# EAGLE design SFT_MotorController1.0v (EAGLE 7.5.0)
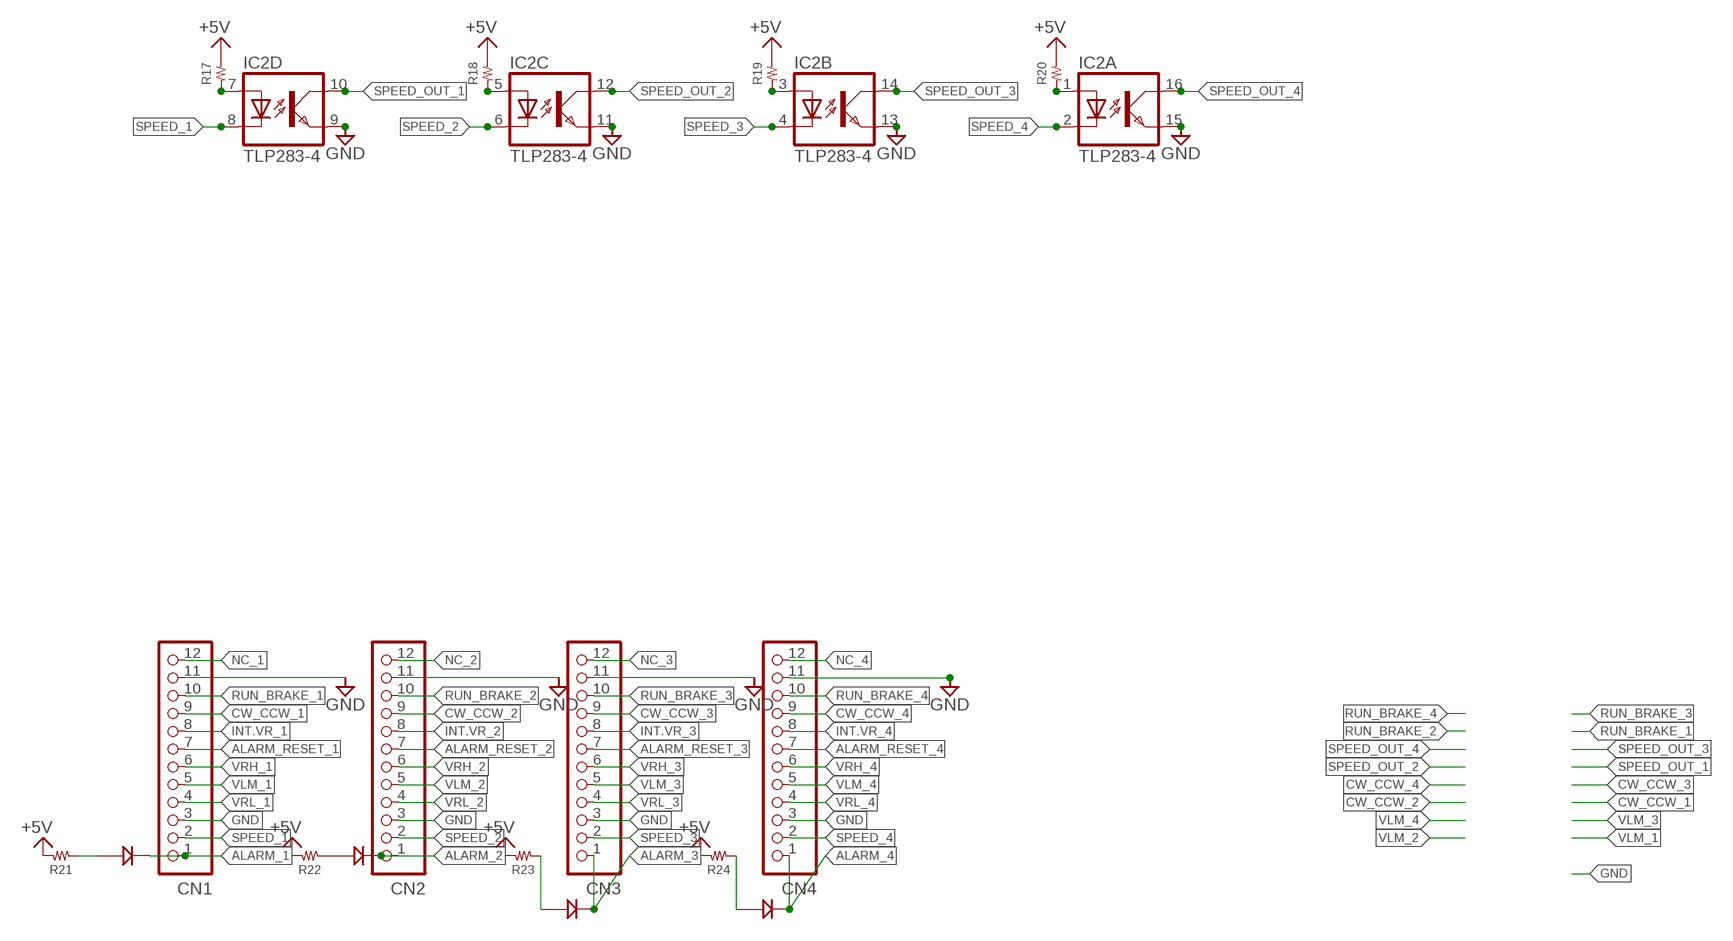
[diagram p0: schematic, sheet 1, part 1 of 2]
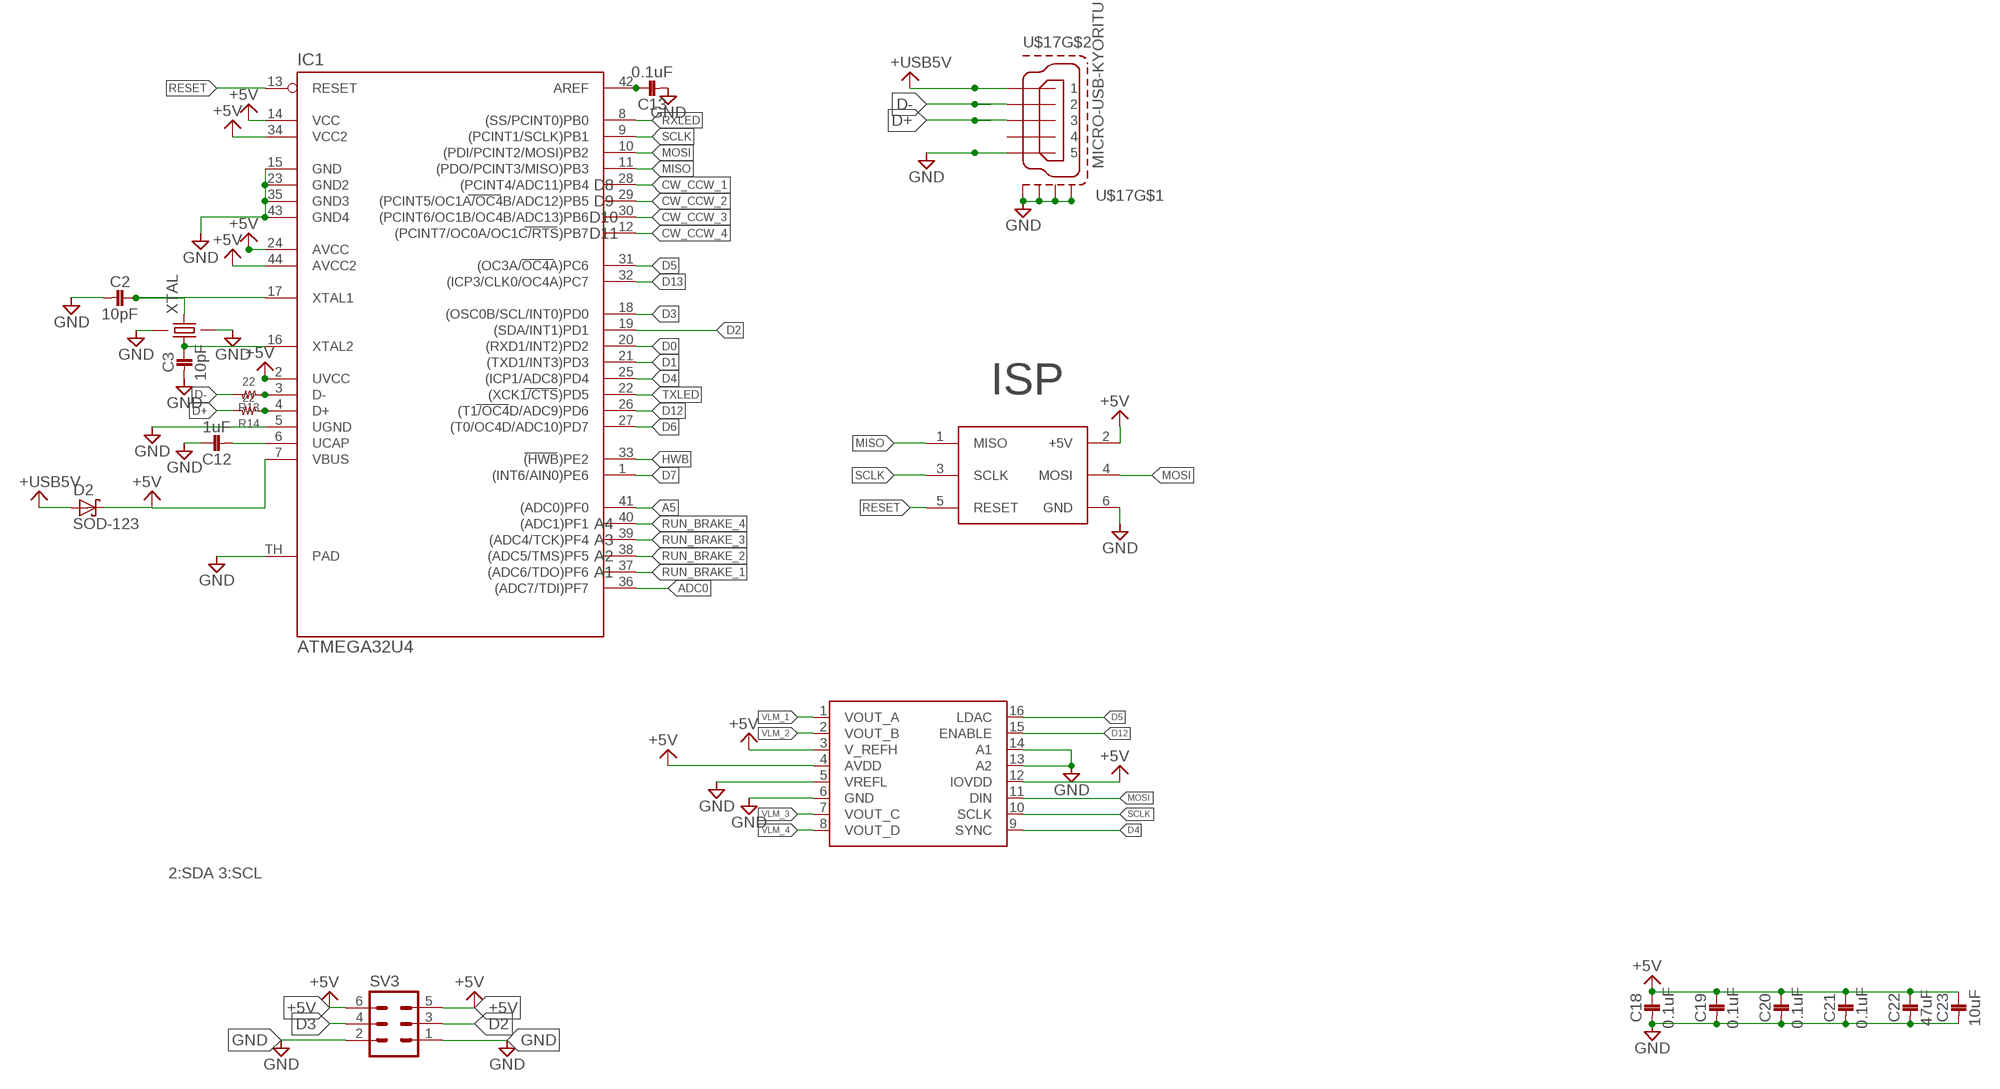
[diagram p1: schematic, sheet 1, part 2 of 2]

## Parts
C2  10pF  1005  [1005]
C3  10pF  1005  [1005]
C12  1uF  1005  [1005]
C13  0.1uF  1005  [1005]
C18  0.1uF  1005  [1005]
C19  0.1uF  1005  [1005]
C20  0.1uF  1005  [1005]
C21  0.1uF  1005  [1005]
C22  47uF  1608  [1608]
C23  10uF  1608  [1608]
CN1  B12B-XASK-1  [B12B-XASK-1]
CN2  B12B-XASK-1  [B12B-XASK-1]
CN3  B12B-XASK-1  [B12B-XASK-1]
CN4  B12B-XASK-1  [B12B-XASK-1]
D2  SOD-123  [SOD_123]
IC1  ATMEGA32U4  [QFN-44-7X7]
IC2  TLP283-4  [MINI-FLAT-16]
IC3  DAC7564  [TSSOP16]
R13  22  RESISTOR_1005  [1005]
R14  22  RESISTOR_1005  [1005]
R17  RESISTOR__SMD  [1608]
R18  RESISTOR__SMD  [1608]
R19  RESISTOR__SMD  [1608]
R20  RESISTOR__SMD  [1608]
R21  RESISTOR__SMD  [1608]
R22  RESISTOR__SMD  [1608]
R23  RESISTOR__SMD  [1608]
R24  RESISTOR__SMD  [1608]
SV3  ML6  [ML6]
U$8  ICSP  [ICSP]
U$17  MICRO-USB-KYORITU  [ZX62R-B-5P]
U$36  3MMLED  [3MM]
U$37  3MMLED  [3MM]
U$38  3MMLED  [3MM]
U$39  3MMLED  [3MM]
XTAL  FA-238  [FA-238]

## Nets
+5V: C18.1 C19.1 C20.1 C21.1 C22.P$1 C23.P$1 D2.C IC1.2(UVCC) IC1.7(VBUS) IC1.14(VCC) IC1.24(AVCC) IC1.34(VCC2) IC1.44(AVCC2) IC3.3(V_REFH) IC3.4(AVDD) IC3.12(IOVDD) R17.2 R18.2 R19.2 R20.2 R21.2 R22.2 R23.2 R24.2 SV3.5 SV3.6 U$8.2(+5V)
+USB5V: D2.A U$17.5
A5: IC1.41((ADC0)PF0)
ADC0: IC1.36((ADC7/TDI)PF7)
ALARM_1: CN1.1 U$37.K
ALARM_2: CN2.1 U$38.K
ALARM_3: CN3.1 U$36.K
ALARM_4: CN4.1 U$39.K
ALARM_RESET_1: CN1.7
ALARM_RESET_2: CN2.7
ALARM_RESET_3: CN3.7
ALARM_RESET_4: CN4.7
CW_CCW_1: CN1.9 IC1.28((PCINT4/ADC11)PB4)
CW_CCW_2: CN2.9 IC1.29((PCINT5/OC1A/OC4B/ADC12)PB5)
CW_CCW_3: CN3.9 IC1.30((PCINT6/OC1B/OC4B/ADC13)PB6)
CW_CCW_4: CN4.9 IC1.12((PCINT7/OC0A/OC1C/RTS)PB7)
D0: IC1.20((RXD1/INT2)PD2)
D1: IC1.21((TXD1/INT3)PD3)
D2: IC1.19((SDA/INT1)PD1) SV3.3
D3: IC1.18((OSC0B/SCL/INT0)PD0) SV3.4
D4: IC1.25((ICP1/ADC8)PD4) IC3.9(SYNC)
D5: IC1.31((OC3A/OC4A)PC6) IC3.16(LDAC)
D6: IC1.27((T0/OC4D/ADC10)PD7)
D7: IC1.1((INT6/AIN0)PE6)
D12: IC1.26((T1/OC4D/ADC9)PD6) IC3.15(ENABLE)
D13: IC1.32((ICP3/CLK0/OC4A)PC7)
D+: R14.2 U$17.3
D-: R13.2 U$17.4
GND: C2.2 C3.2 C12.1 C13.2 C18.2 C19.2 C20.2 C21.2 C22.P$2 C23.P$2 CN1.3 CN1.11 CN2.3 CN2.11 CN3.3 CN3.11 CN4.3 CN4.11 IC1.5(UGND) IC1.15(GND) IC1.23(GND2) IC1.35(GND3) IC1.43(GND4) IC1.TH(PAD) IC2.9(D:EMIT) IC2.11(C:EMIT) IC2.13(B:EMIT) IC2.15(A:EMIT) IC3.5(VREFL) IC3.6(GND) IC3.13(A2) IC3.14(A1) SV3.1 SV3.2 U$8.6(GND) U$17.1 U$17.M1(S1) U$17.M2(S2) U$17.M3(S3) U$17.M4(S4) XTAL.2 XTAL.4
HWB: IC1.33((HWB)PE2)
INT.VR_1: CN1.8
INT.VR_2: CN2.8
INT.VR_3: CN3.8
INT.VR_4: CN4.8
MISO: IC1.11((PDO/PCINT3/MISO)PB3) U$8.1(MISO)
MOSI: IC1.10((PDI/PCINT2/MOSI)PB2) IC3.11(DIN) U$8.4(MOSI)
N$1: IC1.3(D-) R13.1
N$2: IC1.4(D+) R14.1
N$3: C3.1 IC1.16(XTAL2) XTAL.1
N$4: R22.1 U$38.A
N$5: IC2.3(B:A) R19.1
N$6: IC2.5(C:A) R18.1
N$7: IC2.7(D:A) R17.1
N$8: IC2.1(A:A) R20.1
N$9: C13.1 IC1.42(AREF)
N$10: C2.1 IC1.17(XTAL1) XTAL.3
N$13: R21.1 U$37.A
N$15: R23.1 U$36.A
N$16: R24.1 U$39.A
N$18: C12.2 IC1.6(UCAP)
NC_1: CN1.12
NC_2: CN2.12
NC_3: CN3.12
NC_4: CN4.12
RESET: IC1.13(RESET) U$8.5(RESET)
RUN_BRAKE_1: CN1.10 IC1.37((ADC6/TDO)PF6)
RUN_BRAKE_2: CN2.10 IC1.38((ADC5/TMS)PF5)
RUN_BRAKE_3: CN3.10 IC1.39((ADC4/TCK)PF4)
RUN_BRAKE_4: CN4.10 IC1.40((ADC1)PF1)
RXLED: IC1.8((SS/PCINT0)PB0)
SCLK: IC1.9((PCINT1/SCLK)PB1) IC3.10(SCLK) U$8.3(SCLK)
SPEED_1: CN1.2 IC2.8(D:C)
SPEED_2: CN2.2 IC2.6(C:C)
SPEED_3: CN3.2 IC2.4(B:C)
SPEED_4: CN4.2 IC2.2(A:C)
SPEED_OUT_1: IC2.10(D:COL)
SPEED_OUT_2: IC2.12(C:COL)
SPEED_OUT_3: IC2.14(B:COL)
SPEED_OUT_4: IC2.16(A:COL)
TXLED: IC1.22((XCK1/CTS)PD5)
VLM_1: CN1.5 IC3.1(VOUT_A)
VLM_2: CN2.5 IC3.2(VOUT_B)
VLM_3: CN3.5 IC3.7(VOUT_C)
VLM_4: CN4.5 IC3.8(VOUT_D)
VRH_1: CN1.6
VRH_2: CN2.6
VRH_3: CN3.6
VRH_4: CN4.6
VRL_1: CN1.4
VRL_2: CN2.4
VRL_3: CN3.4
VRL_4: CN4.4
Unconnected: U$17.2

## Notes on the sheet
- D8
- D9
- D10
- D11
- ISP
- A4
- A3
- A2
- A1
- 2:SDA 3:SCL

## Library data of the parts
C2 C3 C12 C13 C18-C21 = 02_C:1005
C22 C23 = 02_C:1608
CN1-CN4 = jst-xa:B12B-XASK-1: Wire-to-Board 2.5mm pitch top mount connector Source: http://www.jst-mfg.com/product/pdf/jpn/XA1.pdf http://www.jst-mfg.com/product/detail.php?series=272
D2 = 15_DIODE:SOD-123
IC1 = 04_IC:ATMEGA32U4
IC2 = optocoupler:TLP283-4: TOSHIBA PHOTOCOUPLER GaAs IRED & PHOTO-TRANSISTOR Source: http://www.semicon.toshiba.co.jp/td/en/Opto/Photocoupler/en_20050928_TLP283_datasheet.pdf; OC_FARNELL: unknown; OC_NEWARK: unknown
IC3 = 04_IC:DAC7564
R13 R14 = 01_R:RESISTOR_1005
R17-R24 = 01_R:RESISTOR__SMD
SV3 = con-ml:ML6: HARTING; OC_FARNELL: unknown; OC_NEWARK: unknown
U$8 = 08_CONECTOR:ICSP
U$17 = con-hirose1:MICRO-USB-KYORITU
U$36-U$39 = 10_LED:3MMLED
XTAL = 09_2_CRYSTAL:FA-238

## Board
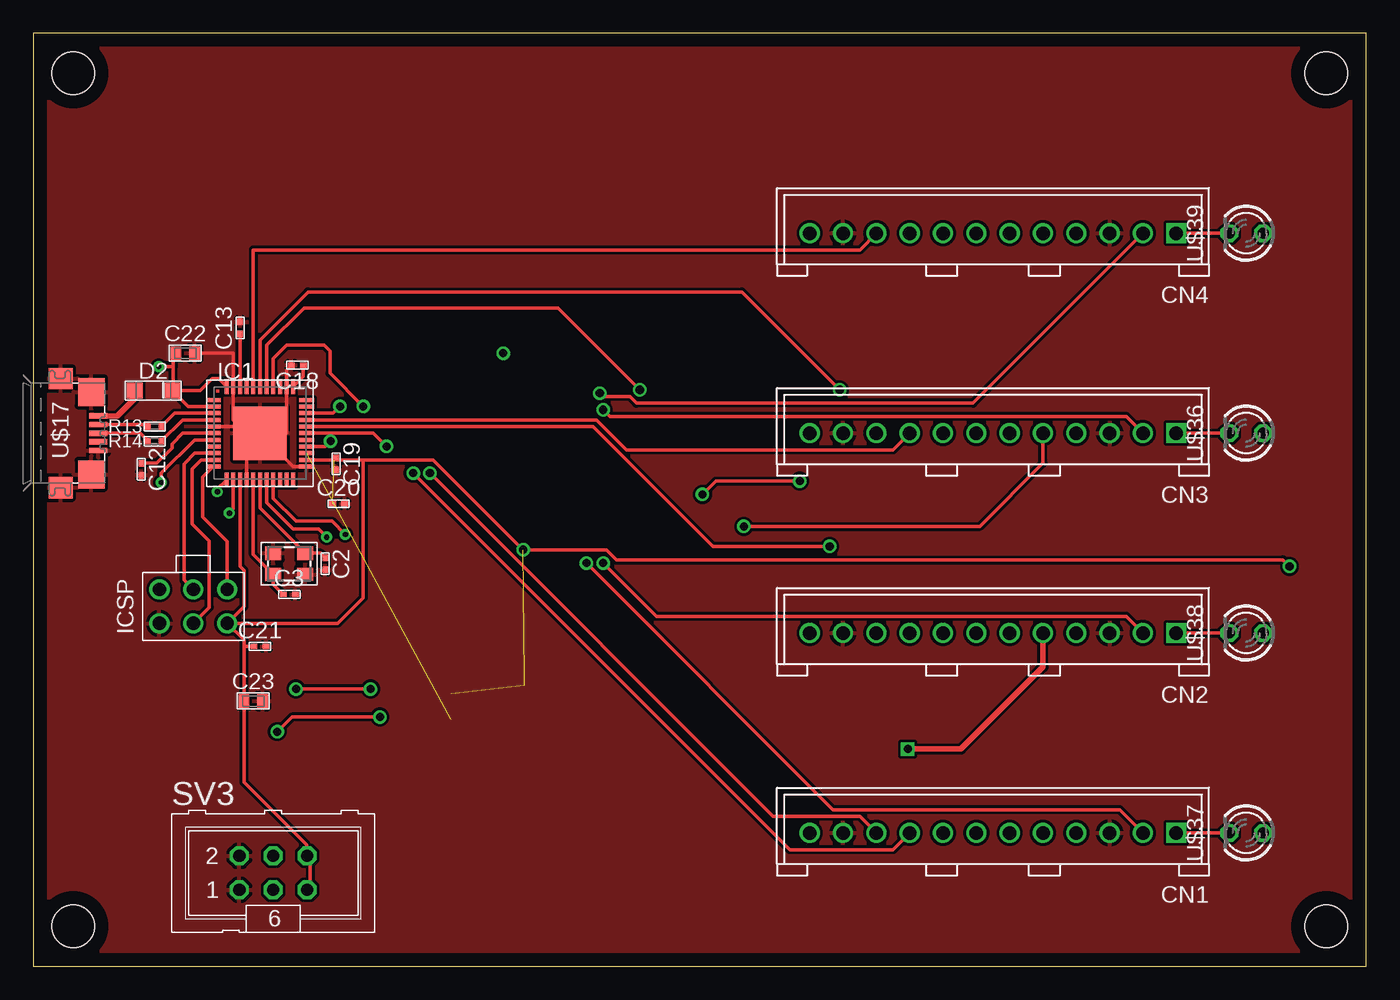
[diagram p2: board, top side]
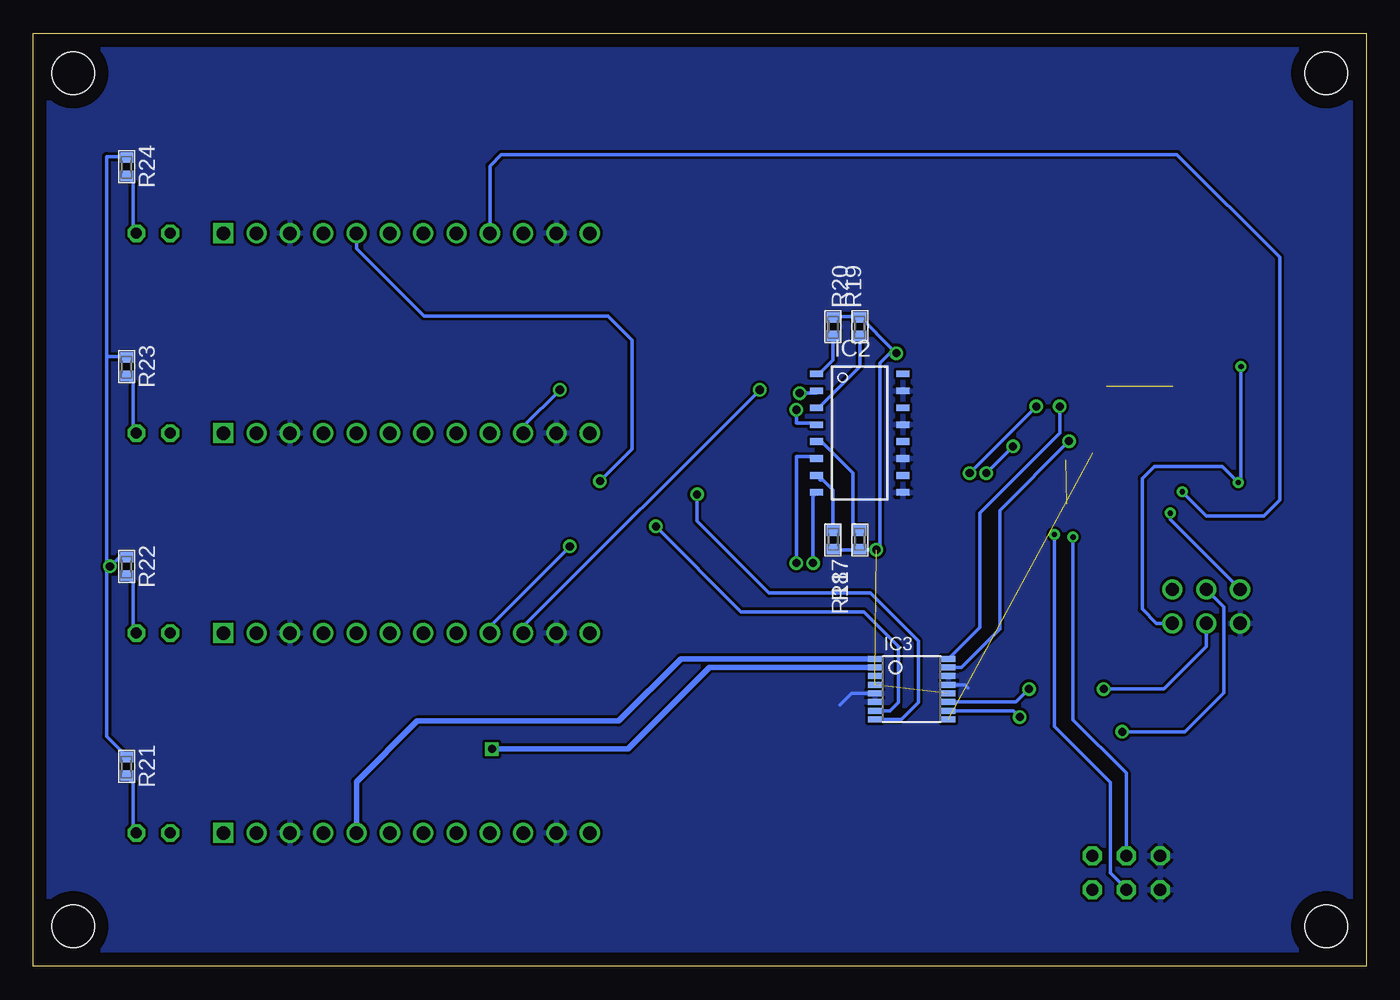
[diagram p3: board, bottom side, seen from below]

Size 100 x 70 mm. Coordinates in mm from the lower left corner, seen from the top.
Outline: 100,70 0,70 0,0 100,0 100,70
Copper layers (1*16): Top 0.035mm / dielectric 1.5mm / Bottom 0.035mm
Design rules "default": minimum track width 10mil, minimum drill 24mil, track to track 8mil, track to pad 8mil, pad to pad 8mil, via to via 8mil, smd to smd 8mil, copper to edge 40mil, drill to drill 8mil, minimum pad ring 10mil, minimum via ring 8mil, stop-mask expansion 4mil, vias tented up to drill 0mil, thermal gap 10mil
Holes 3.2 mm at 97,3 97,67 3,67 3,3

### Footprints (pad centres in the part's own frame; a part is rotated, then mirrored left to right if it is on the bottom)
1005 = smd 0.5 x 0.4: 1 -0.45,0; 2 0.45,0
1608 = smd 0.8 x 1: P$1 -0.7,0; P$2 0.7,0
B12B-XASK-1 = drill 1.016 square: 1 -13.75,0 | drill 1.016: 2 -11.25,0; 3 -8.75,0; 4 -6.25,0; 5 -3.75,0; 6 -1.25,0; 7 1.25,0; 8 3.75,0; 9 6.25,0; 10 8.75,0; 11 11.25,0; 12 13.75,0
SOD_123 = smd 1.2 x 1.2: A -1.4,0; C 1.4,0
QFN-44-7X7 = smd 1.1 x 0.3: 1 -3.5,2.5; 2 -3.5,2; 3 -3.5,1.5; 4 -3.5,1; 5 -3.5,0.5; 6 -3.5,0; 7 -3.5,-0.5; 8 -3.5,-1; 9 -3.5,-1.5; 10 -3.5,-2; 11 -3.5,-2.5; 23 3.5,-2.5; 24 3.5,-2; 25 3.5,-1.5; 26 3.5,-1; 27 3.5,-0.5; 28 3.5,0; 29 3.5,0.5; 30 3.5,1; 31 3.5,1.5; 32 3.5,2; 33 3.5,2.5 | smd 0.3 x 1.1: 12 -2.5,-3.5; 13 -2,-3.5; 14 -1.5,-3.5; 15 -1,-3.5; 16 -0.5,-3.5; 17 0,-3.5; 18 0.5,-3.5; 19 1,-3.5; 20 1.5,-3.5; 21 2,-3.5; 22 2.5,-3.5; 34 2.5,3.5; 35 2,3.5; 36 1.5,3.5; 37 1,3.5; 38 0.5,3.5; 39 0,3.5; 40 -0.5,3.5; 41 -1,3.5; 42 -1.5,3.5; 43 -2,3.5; 44 -2.5,3.5 | smd 4 x 4: TH 0,0
MINI-FLAT-16 = smd 1 x 0.5: 1 -3.24,4.445; 2 -3.24,3.175; 3 -3.24,1.905; 4 -3.24,0.635; 5 -3.24,-0.635; 6 -3.24,-1.905; 7 -3.24,-3.175; 8 -3.24,-4.445; 9 3.24,-4.445; 10 3.24,-3.175; 11 3.24,-1.905; 12 3.24,-0.635; 13 3.24,0.635; 14 3.24,1.905; 15 3.24,3.175; 16 3.24,4.445
TSSOP16 = smd 0.45 x 1.05: 1 -2.275,-2.768; 2 -1.625,-2.768; 3 -0.975,-2.768; 4 -0.325,-2.768; 5 0.325,-2.768; 6 0.975,-2.768; 7 1.625,-2.768; 8 2.275,-2.768; 9 2.275,2.768; 10 1.625,2.768; 11 0.975,2.768; 12 0.325,2.768; 13 -0.325,2.768; 14 -0.975,2.768; 15 -1.625,2.768; 16 -2.275,2.768
1005' = smd 0.4 x 0.5: 1 -0.5,0; 2 0.5,0
1608' = smd 0.8 x 1: 1 -0.7,0; 2 0.7,0
ML6 = drill 0.914 octagon: 1 -2.54,-1.27; 2 -2.54,1.27; 3 0,-1.27; 4 0,1.27; 5 2.54,-1.27; 6 2.54,1.27
ICSP = drill 1 pad 1.5: 1 -1.27,2.54; 2 1.27,2.54; 3 -1.27,0; 4 1.27,0; 5 -1.27,-2.54; 6 1.27,-2.54
ZX62R-B-5P = smd 1.35 x 0.4: 1 2.875,-1.3; 2 2.875,-0.65; 3 2.875,0; 4 2.875,0.65; 5 2.875,1.3 | smd 1.8 x 1.6: M1 0.05,-4.1; M2 0.05,4.1 | smd 2 x 2.1: M3 2.35,3.1; M4 2.35,-3.1
3MM = drill 0.813 octagon: A 0,1.27; K 0,-1.27
FA-238 = smd 1.2 x 1: 1 -1.2,-0.8; 2 1.2,-0.8; 3 1.2,0.8; 4 -1.2,0.8

### Placement (x,y rotation side)
C2  21.9,30.2 270 top
C3  19.2,27.9 0 top
C12  8.1,37.3 90 top
C13  15.5,47.9 90 top
C18  19.8,45.1 180 top
C19  22.7,37.7 270 top
C20  22.9,34.7 0 top
C21  17,24 0 top
C22  11.4,46 0 top
C23  16.5,19.9 0 top
CN1  72,10 180 top
CN2  72,25 180 top
CN3  72,40 180 top
CN4  72,55 180 top
D2  9,43.2 0 top
IC1  17,40 0 top
IC2  38,40 0 bottom
IC3  34.1,20.8 270 bottom
R13  22  [1005']  9.1,40.5 180 top
R14  22  [1005']  9.1,39.4 180 top
R17  [1608']  40,32 270 bottom
R18  [1608']  38,32 270 bottom
R19  [1608']  38,48 90 bottom
R20  [1608']  40,48 90 bottom
R21  [1608']  93,15 90 bottom
R22  [1608']  93,30 90 bottom
R23  [1608']  93,45 90 bottom
R24  [1608']  93,60 90 bottom
SV3  18,7 0 top
U$8  12,27 270 top
U$17  2,40 0 top
U$36  91,40 270 top
U$37  91,10 270 top
U$38  91,25 270 top
U$39  91,55 270 top
XTAL  19.2,30.2 0 top

### Tracks (layer width: path | path; a pad name or v marks a point on that pad's centre or on a via)
+5V  (via drill 0.4, 0.61)  (5 unrouted)
  Top 0.25: IC1.14 15.5,30 15.8,29.7 15.8,26.99 U$8.2 | IC1.2 11.6,42 D2.C 12.5,43.2 13.4,44.1 13.9,44.1 IC1.44 | IC1.24 22.55,38 C19.1 | IC1.7 12.1,39.5 9.6,37 v9.6,36.3 | v9.4,45 10.5,45 | 24.75,38 24.75,27.65 22.83,25.73 U$8.2 | IC1.34 20.25,44.25 C18.1 | 20.5,8.5 20.5,9.1 15.8,13.8 C23.P$1 15.8,24 | 15.8,24 15.8,24.47 U$8.2 | C21.1 15.8,24
  Top 0.254: C19.1 22.75,38 24.75,38 30,38 v36.75,31.25 43,31.25 43.75,30.5 93.75,30.5 v94.25,30 | C22.P$1 10.5,46 10.5,45 10.5,43.25 D2.C | SV3.5 20.75,5.75 20.75,8.25 SV3.6 20.5,8.5
  Bottom 0.25: v9.4,45 9.4,36.5 v9.6,36.3 10.8,37.5 15.9,37.5 16.8,36.6 16.8,26.8 15.73,25.73 U$8.2
  Bottom 0.254: 94.5,29.75 94.5,17.25 93,15.75 R21.2 | 94.5,29.75 v94.25,30 93.5,30.75 93,30.75 R22.2 | 94.5,45.75 93,45.75 R23.2 | 94.5,29.75 94.5,45.75 | 94.5,45.75 94.5,60.75 93,60.75 R24.2 | 38,48.75 35.5,46.25 | 38,48.75 40,48.75 R20.2 | 38,48.75 R19.2 | 38,31.25 40,31.25 R17.2 | 38,31.25 v36.75,31.25 36.5,31.5 36.5,45.25 35.5,46.25 | 38,31.25 R18.2 | 35.5,46.25 v35.25,46
+USB5V
  Top 0.4: U$17.5 6.3,41.3 7.6,42.6 D2.A
ALARM_1
  Top 0.254: CN1.1 U$37.K
ALARM_2
  Top 0.254: CN2.1 U$38.K
ALARM_3
  Top 0.254: CN3.1 U$36.K
ALARM_4
  Top 0.254: CN4.1 U$39.K
CW_CCW_1  (via drill 0.61)
  Top 0.254: IC1.28 25.5,40 v26.5,39 | v28.5,37 56.75,8.75 64.5,8.75 CN1.9
  Bottom 0.254: v28.5,37 v26.5,39
CW_CCW_2  (via drill 0.61)
  Top 0.254: IC1.29 42,40.5 51,31.5 v59.75,31.5
  Bottom 0.254: v59.75,31.5 65.75,25.5 CN2.9
CW_CCW_3
  Top 0.254: IC1.30 42.25,41 44.5,38.75 64.5,38.75 CN3.9
CW_CCW_4  (via drill 0.4)
  Top 0.25: IC1.12 13.8,35.8 v13.8,35.6
  Bottom 0.25: v13.8,35.6 12,33.8 7.7,33.8 6.5,35 6.5,53.2 14.2,60.9 64.9,60.9 65.75,60.05 CN4.9
D2  (via drill 0.4)
  Top 0.25: IC1.19 18,35.1 19.7,33.4 22.4,33.4 v23.4,32.4
  Bottom 0.25: v23.4,32.4 23.4,18 19.2,13.8 19.2,7 18,5.8 SV3.3
D3  (via drill 0.4)
  Top 0.25: IC1.18 17.5,34.8 19.5,32.8 21.4,32.8 v22,32.2
  Bottom 0.25: v22,32.2 22,18.5 18,14.5 SV3.4
D4  (1 unrouted)
D5  (via drill 0.6)
  Top 0.25: v23,42 22.5,41.5 IC1.31
  Bottom 0.25: IC3.16 29,25.41 29,34 23,40 v23,42
D12  (via drill 0.6)
  Top 0.25: v22.3,39.4 21.9,39 IC1.26
  Bottom 0.25: IC3.15 30.38,22.43 27.5,25.3 27.5,34.2 v22.3,39.4
D+
  Top 0.25: R14.2 8,40 U$17.3
D-
  Top 0.25: R13.2 8.45,40.65 U$17.4
GND
  Top 0.25: IC1.5 15.5,40.5 | 15.5,40.5 16,40 | IC1.43 15,41 15.5,40.5 | C18.2 19,44.75 IC1.35 19,42 IC1.TH 19.5,37.5 IC1.23
  Top 0.254: IC1.15 16,40 IC1.TH 19,40 IC1.35 | IC1.43 15,46 C22.P$2
  Bottom 0.25: IC3.13 30.12,21.12 29.9,20.9 | IC3.5 38.62,20.48 39.5,19.6
  pour Bottom: 111,-4 -5,-4 -5,82 111,82
  pour Top: 115,-7 -11,-7 -11,84 115,84
MISO
  Top 0.25: IC1.11 12.7,36.7 12.7,33.7 14.54,31.86 U$8.1
MOSI  (via drill 0.6)
  Top 0.25: U$8.4 13.2,26.93 13.2,31.9 11.9,33.2 11.9,37.3 12.6,38 IC1.10 | v25.3,20.8 v19.7,20.8
  Bottom 0.25: IC3.11 26.27,19.82 v25.3,20.8 | v19.7,20.8 15.2,20.8 12,24 U$8.4
N$1
  Top 0.25: R13.1 10.6,41.5 IC1.3
N$2
  Top 0.25: R14.1 11.2,41 IC1.4
N$3
  Top 0.25: IC1.16 16.5,30.9 XTAL.1 18,28.65 C3.1
N$4
  Bottom 0.254: R22.1 93,29.25 92.5,28.75 92.5,25 U$38.A
N$5
  Bottom 0.254: R19.1 38,45 41,42 IC2.3
N$6
  Bottom 0.254: R18.1 38,32.75 38.5,33.25 38.5,37 41,39.5 IC2.5
N$7
  Bottom 0.254: R17.1 40,35.75 40.75,36.5 41,36.5 41,36.75 IC2.7
N$8
  Bottom 0.254: R20.1 40,45.5 41,44.5 IC2.1
N$9
  Top 0.254: IC1.42 C13.1
N$10
  Top 0.25: IC1.17 17,34.4 XTAL.3 21.55,31 C2.1
N$13
  Bottom 0.254: R21.1 93,14.25 92.5,13.75 92.5,10 U$37.A
N$15
  Bottom 0.254: R23.1 93,44.25 92.5,43.75 92.5,40 U$36.A
N$16
  Bottom 0.254: R24.1 93,59.25 92.5,58.75 92.5,55 U$39.A
N$18
  Top 0.25: IC1.6 11.2,40 10.4,39.2 10.4,38.9 9.25,37.75 C12.2
RESET  (via drill 0.4)
  Top 0.25: v14.7,34 15,34.3 IC1.13
  Bottom 0.25: U$8.5 14.7,33.51 v14.7,34
RUN_BRAKE_1  (via drill 0.61)
  Top 0.25: 18,44.5 18,45.6 19,46.6 21.8,46.6 22.25,46.15 22.25,44.5
  Top 0.254: 18,44.5 IC1.37 | v24.75,42 22.25,44.5 | v29.75,37 55.5,11.25 62,11.25 CN1.10
  Bottom 0.254: v29.75,37 v24.75,42
RUN_BRAKE_2  (via drill 0.61)
  Top 0.25: 44.12,44.62 39.35,49.4 20.3,49.4 17.5,46.6 17.5,45
  Top 0.254: 17.5,45 IC1.38 | v45.5,43.25 44.12,44.62 43.75,45
  Bottom 0.254: v45.5,43.25 63.25,25.5 CN2.10
RUN_BRAKE_3  (via drill 0.61)
  Top 0.25: 17,47 20.6,50.6 53.15,50.6 56.75,47
  Top 0.254: 17,47 IC1.39 | v60.5,43.25 56.75,47
  Bottom 0.254: v60.5,43.25 63.25,40.5 CN3.10
RUN_BRAKE_4
  Top 0.254: IC1.40 16.5,53.75 62,53.75 CN4.10
SCLK  (via drill 0.6)
  Top 0.25: U$8.3 11.3,28.97 11.3,37.7 12.1,38.5 IC1.9 | v26,18.7 19.4,18.7 v18.3,17.6
  Bottom 0.25: IC3.10 26.48,19.18 v26,18.7 | v18.3,17.6 13.6,17.6 10.7,20.5 10.7,26.97 U$8.3
SPEED_1  (via drill 0.61)
  Top 0.254: v41.5,30.25 60,11.75 81.5,11.75 CN1.2
  Bottom 0.254: v41.5,30.25 41.5,35.25 41.25,35.5 IC2.8
SPEED_2  (via drill 0.61)
  Top 0.254: v42.75,30.25 46.75,26.25 82,26.25 CN2.2
  Bottom 0.254: v42.75,30.25 42.75,38.25 41.25,38.25 IC2.6
SPEED_3  (via drill 0.61)
  Top 0.254: v42.75,41.75 43.25,41.25 82,41.25 CN3.2
  Bottom 0.254: v42.75,41.75 42.75,40.75 41.25,40.75 IC2.4
SPEED_4  (via drill 0.61)
  Top 0.254: v42.5,43 42.75,42.75 44.75,42.75 45.25,42.25 70.5,42.25 CN4.2
  Bottom 0.254: v42.5,43 41.25,43 IC2.2
VLM_1
  Bottom 0.406: IC3.1 51.42,23.07 56.1,18.4 71.2,18.4 75.75,13.85 CN1.5
VLM_2  (via drill 0.6)
  Top 0.406: v65.6,16.3 69.6,16.3 75.75,22.45 CN2.5
  Bottom 0.406: IC3.2 49.27,22.43 55.4,16.3 v65.6,16.3
VLM_3  (via drill 0.6)
  Top 0.25: v53.3,33 71,33 75.75,37.75 CN3.5
  Bottom 0.25: IC3.7 35.73,19.18 35.1,19.8 35.1,24 37.7,26.6 46.9,26.6 v53.3,33
VLM_4  (via drill 0.6)
  Top 0.25: v50.2,35.4 51.2,36.4 v57.5,36.4
  Bottom 0.25: IC3.8 34.88,18.52 33.6,19.8 33.6,24.4 37.2,28 44.8,28 50.2,33.4 v50.2,35.4 | v57.5,36.4 55.1,38.8 55.1,47 56.9,48.8 70.7,48.8 75.75,53.85 CN4.5